# Altium schematic sheet MOSFETS.SchDoc
size B; SheetNumber: 6; SheetTotal: 6
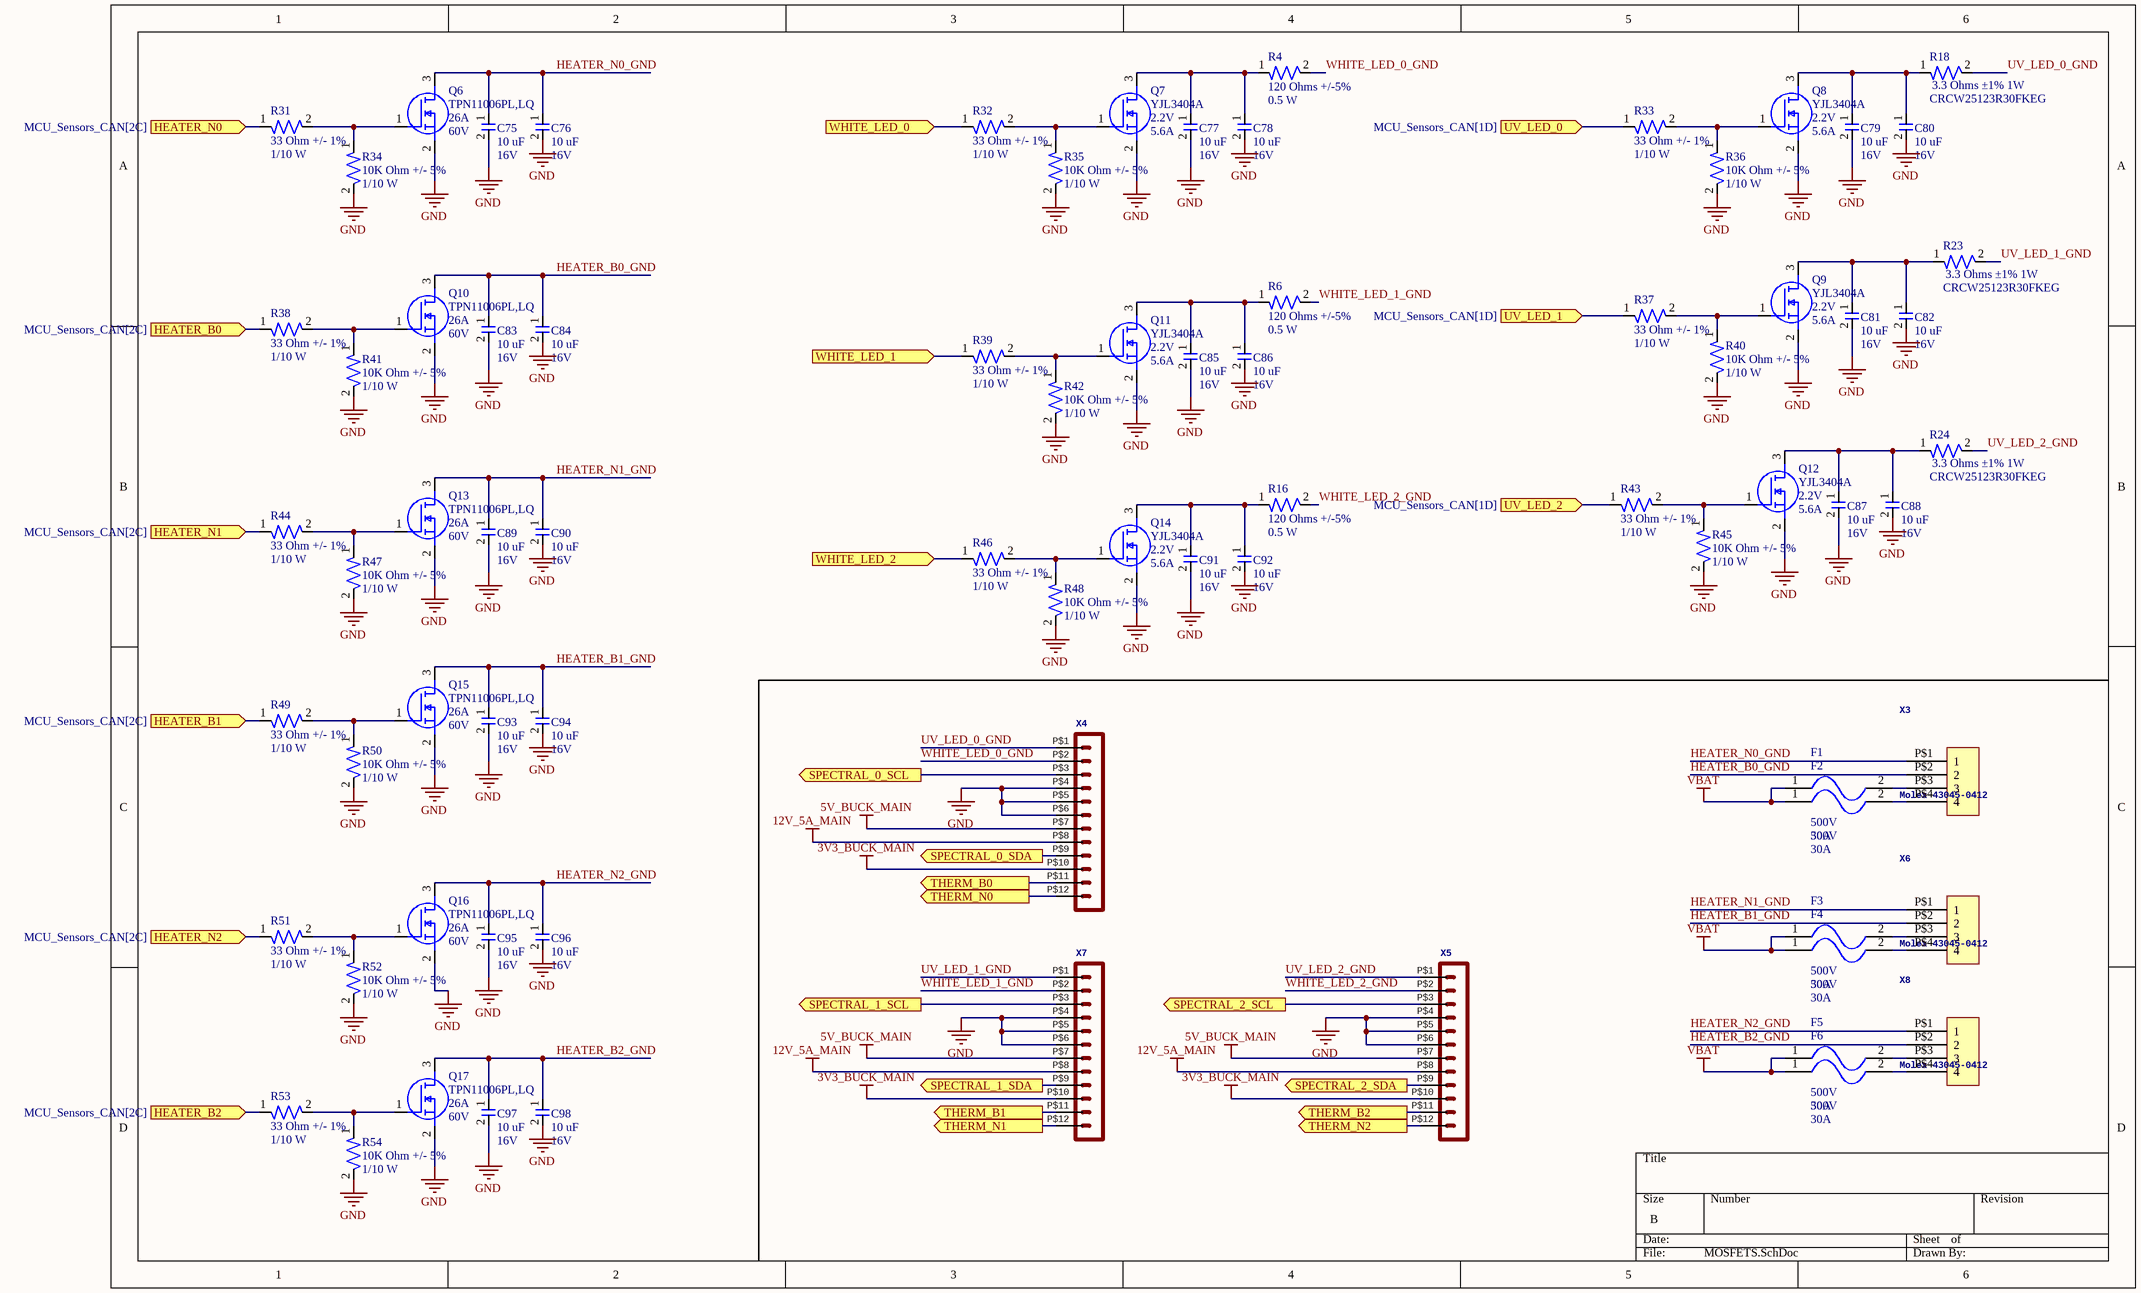
[diagram p0: MOSFETS.SchDoc]

## Parts
C75  Capacitance: 10 uF  Voltage Rating: 16V  [CAP-0805]  (hidden comment: CL21A106KOQNNNE)
C76  Capacitance: 10 uF  Voltage Rating: 16V  [CAP-0805]  (hidden comment: CL21A106KOQNNNE)
C77  Capacitance: 10 uF  Voltage Rating: 16V  [CAP-0805]  (hidden comment: CL21A106KOQNNNE)
C78  Capacitance: 10 uF  Voltage Rating: 16V  [CAP-0805]  (hidden comment: CL21A106KOQNNNE)
C79  Capacitance: 10 uF  Voltage Rating: 16V  [CAP-0805]  (hidden comment: CL21A106KOQNNNE)
C80  Capacitance: 10 uF  Voltage Rating: 16V  [CAP-0805]  (hidden comment: CL21A106KOQNNNE)
C81  Capacitance: 10 uF  Voltage Rating: 16V  [CAP-0805]  (hidden comment: CL21A106KOQNNNE)
C82  Capacitance: 10 uF  Voltage Rating: 16V  [CAP-0805]  (hidden comment: CL21A106KOQNNNE)
C83  Capacitance: 10 uF  Voltage Rating: 16V  [CAP-0805]  (hidden comment: CL21A106KOQNNNE)
C84  Capacitance: 10 uF  Voltage Rating: 16V  [CAP-0805]  (hidden comment: CL21A106KOQNNNE)
C85  Capacitance: 10 uF  Voltage Rating: 16V  [CAP-0805]  (hidden comment: CL21A106KOQNNNE)
C86  Capacitance: 10 uF  Voltage Rating: 16V  [CAP-0805]  (hidden comment: CL21A106KOQNNNE)
C87  Capacitance: 10 uF  Voltage Rating: 16V  [CAP-0805]  (hidden comment: CL21A106KOQNNNE)
C88  Capacitance: 10 uF  Voltage Rating: 16V  [CAP-0805]  (hidden comment: CL21A106KOQNNNE)
C89  Capacitance: 10 uF  Voltage Rating: 16V  [CAP-0805]  (hidden comment: CL21A106KOQNNNE)
C90  Capacitance: 10 uF  Voltage Rating: 16V  [CAP-0805]  (hidden comment: CL21A106KOQNNNE)
C91  Capacitance: 10 uF  Voltage Rating: 16V  [CAP-0805]  (hidden comment: CL21A106KOQNNNE)
C92  Capacitance: 10 uF  Voltage Rating: 16V  [CAP-0805]  (hidden comment: CL21A106KOQNNNE)
C93  Capacitance: 10 uF  Voltage Rating: 16V  [CAP-0805]  (hidden comment: CL21A106KOQNNNE)
C94  Capacitance: 10 uF  Voltage Rating: 16V  [CAP-0805]  (hidden comment: CL21A106KOQNNNE)
C95  Capacitance: 10 uF  Voltage Rating: 16V  [CAP-0805]  (hidden comment: CL21A106KOQNNNE)
C96  Capacitance: 10 uF  Voltage Rating: 16V  [CAP-0805]  (hidden comment: CL21A106KOQNNNE)
C97  Capacitance: 10 uF  Voltage Rating: 16V  [CAP-0805]  (hidden comment: CL21A106KOQNNNE)
C98  Capacitance: 10 uF  Voltage Rating: 16V  [CAP-0805]  (hidden comment: CL21A106KOQNNNE)
F1  Voltage Rating: 500V  Current: 30A  [FUSE-ATM-0001]  (hidden comment: 3568)
F2  Voltage Rating: 500V  Current: 30A  [FUSE-ATM-0001]  (hidden comment: 3568)
F3  Voltage Rating: 500V  Current: 30A  [FUSE-ATM-0001]  (hidden comment: 3568)
F4  Voltage Rating: 500V  Current: 30A  [FUSE-ATM-0001]  (hidden comment: 3568)
F5  Voltage Rating: 500V  Current: 30A  [FUSE-ATM-0001]  (hidden comment: 3568)
F6  Voltage Rating: 500V  Current: 30A  [FUSE-ATM-0001]  (hidden comment: 3568)
Q6  TPN11006PL,LQ  Id-Continuous: 26A  VDS-Max: 60V  [NMOS-8TSON]
Q7  YJL3404A  Vgs(th): 2.2V  Drain Current: 5.6A  [NMOS-SOT23-3]
Q8  YJL3404A  Vgs(th): 2.2V  Drain Current: 5.6A  [NMOS-SOT23-3]
Q9  YJL3404A  Vgs(th): 2.2V  Drain Current: 5.6A  [NMOS-SOT23-3]
Q10  TPN11006PL,LQ  Id-Continuous: 26A  VDS-Max: 60V  [NMOS-8TSON]
Q11  YJL3404A  Vgs(th): 2.2V  Drain Current: 5.6A  [NMOS-SOT23-3]
Q12  YJL3404A  Vgs(th): 2.2V  Drain Current: 5.6A  [NMOS-SOT23-3]
Q13  TPN11006PL,LQ  Id-Continuous: 26A  VDS-Max: 60V  [NMOS-8TSON]
Q14  YJL3404A  Vgs(th): 2.2V  Drain Current: 5.6A  [NMOS-SOT23-3]
Q15  TPN11006PL,LQ  Id-Continuous: 26A  VDS-Max: 60V  [NMOS-8TSON]
Q16  TPN11006PL,LQ  Id-Continuous: 26A  VDS-Max: 60V  [NMOS-8TSON]
Q17  TPN11006PL,LQ  Id-Continuous: 26A  VDS-Max: 60V  [NMOS-8TSON]
R4  Resistance: 120 Ohms +/-5%  Power: 0.5 W  [RES-0805]  (hidden comment: ERJ-P06J121V)
R6  Resistance: 120 Ohms +/-5%  Power: 0.5 W  [RES-0805]  (hidden comment: ERJ-P06J121V)
R16  Resistance: 120 Ohms +/-5%  Power: 0.5 W  [RES-0805]  (hidden comment: ERJ-P06J121V)
R18  CRCW25123R30FKEG  [RC2512N_VIS]
R23  CRCW25123R30FKEG  [RC2512N_VIS]
R24  CRCW25123R30FKEG  [RC2512N_VIS]
R31  Resistance: 33 Ohm +/- 1%  Power: 1/10 W  [RES-0402]  (hidden comment: ERJ2RKF33R0X)
R32  Resistance: 33 Ohm +/- 1%  Power: 1/10 W  [RES-0402]  (hidden comment: ERJ2RKF33R0X)
R33  Resistance: 33 Ohm +/- 1%  Power: 1/10 W  [RES-0402]  (hidden comment: ERJ2RKF33R0X)
R34  Resistance: 10K Ohm +/- 5%  Power: 1/10 W  [RES-0402]  (hidden comment: ERJ2GEJ103X)
R35  Resistance: 10K Ohm +/- 5%  Power: 1/10 W  [RES-0402]  (hidden comment: ERJ2GEJ103X)
R36  Resistance: 10K Ohm +/- 5%  Power: 1/10 W  [RES-0402]  (hidden comment: ERJ2GEJ103X)
R37  Resistance: 33 Ohm +/- 1%  Power: 1/10 W  [RES-0402]  (hidden comment: ERJ2RKF33R0X)
R38  Resistance: 33 Ohm +/- 1%  Power: 1/10 W  [RES-0402]  (hidden comment: ERJ2RKF33R0X)
R39  Resistance: 33 Ohm +/- 1%  Power: 1/10 W  [RES-0402]  (hidden comment: ERJ2RKF33R0X)
R40  Resistance: 10K Ohm +/- 5%  Power: 1/10 W  [RES-0402]  (hidden comment: ERJ2GEJ103X)
R41  Resistance: 10K Ohm +/- 5%  Power: 1/10 W  [RES-0402]  (hidden comment: ERJ2GEJ103X)
R42  Resistance: 10K Ohm +/- 5%  Power: 1/10 W  [RES-0402]  (hidden comment: ERJ2GEJ103X)
R43  Resistance: 33 Ohm +/- 1%  Power: 1/10 W  [RES-0402]  (hidden comment: ERJ2RKF33R0X)
R44  Resistance: 33 Ohm +/- 1%  Power: 1/10 W  [RES-0402]  (hidden comment: ERJ2RKF33R0X)
R45  Resistance: 10K Ohm +/- 5%  Power: 1/10 W  [RES-0402]  (hidden comment: ERJ2GEJ103X)
R46  Resistance: 33 Ohm +/- 1%  Power: 1/10 W  [RES-0402]  (hidden comment: ERJ2RKF33R0X)
R47  Resistance: 10K Ohm +/- 5%  Power: 1/10 W  [RES-0402]  (hidden comment: ERJ2GEJ103X)
R48  Resistance: 10K Ohm +/- 5%  Power: 1/10 W  [RES-0402]  (hidden comment: ERJ2GEJ103X)
R49  Resistance: 33 Ohm +/- 1%  Power: 1/10 W  [RES-0402]  (hidden comment: ERJ2RKF33R0X)
R50  Resistance: 10K Ohm +/- 5%  Power: 1/10 W  [RES-0402]  (hidden comment: ERJ2GEJ103X)
R51  Resistance: 33 Ohm +/- 1%  Power: 1/10 W  [RES-0402]  (hidden comment: ERJ2RKF33R0X)
R52  Resistance: 10K Ohm +/- 5%  Power: 1/10 W  [RES-0402]  (hidden comment: ERJ2GEJ103X)
R53  Resistance: 33 Ohm +/- 1%  Power: 1/10 W  [RES-0402]  (hidden comment: ERJ2RKF33R0X)
R54  Resistance: 10K Ohm +/- 5%  Power: 1/10 W  [RES-0402]  (hidden comment: ERJ2GEJ103X)
X3  Molex 43045-0412  [43045-0412]
X4  Molex - Micro-Fit 3.0 Series connector,  3.00mm (0.118") pitch header, 12 positions.  [43045-1212]  (value not drawn)
X5  Molex - Micro-Fit 3.0 Series connector,  3.00mm (0.118") pitch header, 12 positions.  [43045-1212]  (value not drawn)
X6  Molex 43045-0412  [43045-0412]
X7  Molex - Micro-Fit 3.0 Series connector,  3.00mm (0.118") pitch header, 12 positions.  [43045-1212]  (value not drawn)
X8  Molex 43045-0412  [43045-0412]

## Ports
HEATER_B0 (in, see MCU_Sensors_CAN[2C]), HEATER_B1 (in, see MCU_Sensors_CAN[2C]), HEATER_B2 (in, see MCU_Sensors_CAN[2C]), HEATER_N0 (in, see MCU_Sensors_CAN[2C]), HEATER_N1 (in, see MCU_Sensors_CAN[2C]), HEATER_N2 (in, see MCU_Sensors_CAN[2C]), SPECTRAL_0_SCL (out, see MCU_Sensors_CAN[5C]), SPECTRAL_0_SDA (out, see MCU_Sensors_CAN[5C]), SPECTRAL_1_SCL (out, see MCU_Sensors_CAN[5C]), SPECTRAL_1_SDA (out, see MCU_Sensors_CAN[5C]), SPECTRAL_2_SCL (out, see MCU_Sensors_CAN[5C]), SPECTRAL_2_SDA (out, see MCU_Sensors_CAN[5C]), THERM_B0 (out, see MCU_Sensors_CAN[6C]), THERM_B1 (out, see MCU_Sensors_CAN[6C]), THERM_B2 (out, see MCU_Sensors_CAN[6D]), THERM_N0 (out, see MCU_Sensors_CAN[6B]), THERM_N1 (out, see MCU_Sensors_CAN[6C]), THERM_N2 (out, see MCU_Sensors_CAN[6C]), UV_LED_0 (in, see MCU_Sensors_CAN[1D]), UV_LED_1 (in, see MCU_Sensors_CAN[1D]), UV_LED_2 (in, see MCU_Sensors_CAN[1D]), WHITE_LED_0 (in, see MCU_Sensors_CAN[1D]), WHITE_LED_1 (in, see MCU_Sensors_CAN[1D]), WHITE_LED_2 (in, see MCU_Sensors_CAN[1D])

## Nets
3V3_BUCK_MAIN: X4.P$10 X5.P$10 X7.P$10
5V_BUCK_MAIN: X4.P$7 X5.P$7 X7.P$7
12V_5A_MAIN: X4.P$8 X5.P$8 X7.P$8
GND: C75.2 C76.2 C77.2 C78.2 C79.2 C80.2 C81.2 C82.2 C83.2 C84.2 C85.2 C86.2 C87.2 C88.2 C89.2 C90.2 C91.2 C92.2 C93.2 C94.2 C95.2 C96.2 C97.2 C98.2 Q6.2(S) Q7.2(S) Q8.2(S) Q9.2(S) Q10.2(S) Q11.2(S) Q12.2(S) Q13.2(S) Q14.2(S) Q15.2(S) Q16.2(S) Q17.2(S) R34.2 R35.2 R36.2 R40.2 R41.2 R42.2 R45.2 R47.2 R48.2 R50.2 R52.2 R54.2 X4.P$4 X4.P$5 X4.P$6 X5.P$4 X5.P$5 X5.P$6 X7.P$4 X7.P$5 X7.P$6
VBAT: F1.1 F2.1 F3.1 F4.1 F5.1 F6.1
HEATER_B0: R38.1 ; port HEATER_B0
HEATER_B0_GND: C83.1 C84.1 Q10.3(D) X3.P$2(2)
HEATER_B1: R49.1 ; port HEATER_B1
HEATER_B1_GND: C93.1 C94.1 Q15.3(D) X6.P$2(2)
HEATER_B2: R53.1 ; port HEATER_B2
HEATER_B2_GND: C97.1 C98.1 Q17.3(D) X8.P$2(2)
HEATER_N0: R31.1 ; port HEATER_N0
HEATER_N0_GND: C75.1 C76.1 Q6.3(D) X3.P$1(1)
HEATER_N1: R44.1 ; port HEATER_N1
HEATER_N1_GND: C89.1 C90.1 Q13.3(D) X6.P$1(1)
HEATER_N2: R51.1 ; port HEATER_N2
HEATER_N2_GND: C95.1 C96.1 Q16.3(D) X8.P$1(1)
SPECTRAL_0_SCL: X4.P$3 ; port SPECTRAL_0_SCL
SPECTRAL_0_SDA: X4.P$9 ; port SPECTRAL_0_SDA
SPECTRAL_1_SCL: X7.P$3 ; port SPECTRAL_1_SCL
SPECTRAL_1_SDA: X7.P$9 ; port SPECTRAL_1_SDA
SPECTRAL_2_SCL: X5.P$3 ; port SPECTRAL_2_SCL
SPECTRAL_2_SDA: X5.P$9 ; port SPECTRAL_2_SDA
THERM_B0: X4.P$11 ; port THERM_B0
THERM_B1: X7.P$11 ; port THERM_B1
THERM_B2: X5.P$11 ; port THERM_B2
THERM_N0: X4.P$12 ; port THERM_N0
THERM_N1: X7.P$12 ; port THERM_N1
THERM_N2: X5.P$12 ; port THERM_N2
UV_LED_0: R33.1 ; port UV_LED_0
UV_LED_0_GND: R18.2 X4.P$1
UV_LED_1: R37.1 ; port UV_LED_1
UV_LED_1_GND: R23.2 X7.P$1
UV_LED_2: R43.1 ; port UV_LED_2
UV_LED_2_GND: R24.2 X5.P$1
WHITE_LED_0: R32.1 ; port WHITE_LED_0
WHITE_LED_0_GND: R4.2 X4.P$2
WHITE_LED_1: R39.1 ; port WHITE_LED_1
WHITE_LED_1_GND: R6.2 X7.P$2
WHITE_LED_2: R46.1 ; port WHITE_LED_2
WHITE_LED_2_GND: R16.2 X5.P$2
NetC77_1: C77.1 C78.1 Q7.3(D) R4.1
NetC79_1: C79.1 C80.1 Q8.3(D) R18.1
NetC81_1: C81.1 C82.1 Q9.3(D) R23.1
NetC85_1: C85.1 C86.1 Q11.3(D) R6.1
NetC87_1: C87.1 C88.1 Q12.3(D) R24.1
NetC91_1: C91.1 C92.1 Q14.3(D) R16.1
NetF1_2: F1.2 X3.P$3(3)
NetF2_2: F2.2 X3.P$4(4)
NetF3_2: F3.2 X6.P$3(3)
NetF4_2: F4.2 X6.P$4(4)
NetF5_2: F5.2 X8.P$3(3)
NetF6_2: F6.2 X8.P$4(4)
NetQ6_1: Q6.1(G) R31.2 R34.1
NetQ7_1: Q7.1(G) R32.2 R35.1
NetQ8_1: Q8.1(G) R33.2 R36.1
NetQ9_1: Q9.1(G) R37.2 R40.1
NetQ10_1: Q10.1(G) R38.2 R41.1
NetQ11_1: Q11.1(G) R39.2 R42.1
NetQ12_1: Q12.1(G) R43.2 R45.1
NetQ13_1: Q13.1(G) R44.2 R47.1
NetQ14_1: Q14.1(G) R46.2 R48.1
NetQ15_1: Q15.1(G) R49.2 R50.1
NetQ16_1: Q16.1(G) R51.2 R52.1
NetQ17_1: Q17.1(G) R53.2 R54.1

## Notes on the sheet
- (in symbol RES-3.3-0001) 3.3 Ohms ±1% 1W

## Library data of the parts
C75-C98 = CAP-10U-0002: 10 µF ±10% 16V Ceramic Capacitor X7R 0805 (2012 Metric); Package Size: 0805
F1-F6 = FUSE-ATM-0001: Fuse Holder 30 A 500V 1 Circuit Blade Through Hole; Manufacturer Part Number: 3568
Q6 Q10 Q13 Q15-Q17 = NMOS-26A-0001: N-Channel 60 V 26A (Tc) 610mW (Ta), 61W (Tc) Surface Mount 8-TSON Advance (3.1x3.1); Manufacturer: Toshiba; Rds On-Max: 18.1mOhm; Vgs-Max: 20V; Assembled?: no; Manufacturer Part Number: TPN11006PL,LQ; FET type: N-Channel; Package: 8-TSON Advance
Q7-Q9 Q11 Q12 Q14 = NMOS-5.6A-0001: N-Channel 30 V 5.6A (Ta) 1.2W (Ta) Surface Mount SOT-23; Vdss: 30V; Rds On: 24 mOhm; Manufacturer Part Number: YJL3404A; Package Size: SOT23
R4 R6 R16 = RES-120-0001: 120 Ohms ±5% 0.5W, 1/2W Chip Resistor 0805 (2012 Metric) Automotive AEC-Q200, Pulse Withstanding Thick Film
R18 R23 R24 = RES-3.3-0001: 3.3 Ohms ±1% 1W Chip Resistor 2512 (6432 Metric) Automotive AEC-Q200 Thick Film
R31-R33 R37-R39 R43 R44 R46 R49 R51 R53 = RES-33-0003-JLC: 100mW Thick Film Resistors ±100ppm/℃ ±1% -55℃~+155℃ 33Ω 0402  Chip Resistor - Surface Mount ROHS; assembled?: yes; JLC part number: C278594
R34-R36 R40-R42 R45 R47 R48 R50 R52 R54 = RES-10K-0003-JLC: 100mW Thick Film Resistors 100V ±5% ±200ppm/℃ -55℃~+155℃ 10kΩ 0402  Chip Resistor - Surface Mount ROHS; assembled?: yes; JLC part number: C278577
X3 X6 X8 = Micro-Fit Molex 4 Pin 2 Row Vertical: GateName_1: G$1; SymbolName_1: HEADER_POS4; DeviceSetName: HEADER_POS4_?; DeviceName: 43045-0412; LibraryName: con-molex-micro-fit-3_0_2; Package: 43045-0412
X4 X5 X7 = HEADER_POS12_?43045-1212: GateName_1: G$1; SymbolName_1: HEADER_POS12; DeviceName: 43045-1212; LibraryName: con-molex-micro-fit-3_0_2; DeviceSetName: HEADER_POS12_?; Package: 43045-1212